# Altium schematic sheet flexPCB.SchDoc
size A
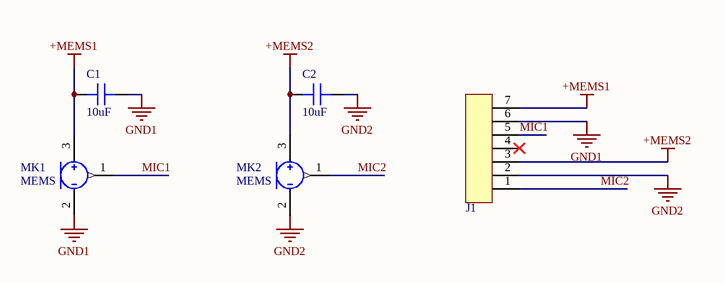
[diagram p0: flexPCB.SchDoc]

## Parts
C1  10uF  [CAP 0402/1005]
C2  10uF  [CAP 0402/1005]
J1  FFC EDGE BOTTOM  [HIROSE_FH58M-7S-0.25SHW-99_BOTTOMFFC]  (value not drawn)
MK1  MEMS  [MIC_CAGRI]
MK2  MEMS  [MIC_CAGRI]

## Nets
+MEMS1: C1.1 J1.7 MK1.3(VDD)
+MEMS2: C2.1 J1.3 MK2.3(VDD)
GND1: C1.2 J1.6 MK1.2(GND)
GND2: C2.2 J1.2 MK2.2(GND)
MIC1: J1.5 MK1.1
MIC2: J1.1 MK2.1

Not connected (* = marked no-connect by the designer): J1 4*

## Library data of the parts
C1 C2 = C1005X5R0J106M050BC: CAP CER 10UF 6.3V X5R 0402; Manufacturer: TDK Corporation; TemperatureRange: -55C ~ 85C; Tolerance: 20%; Value: 10uF; Part Number: C1005X5R0J106M050BC; PartId: 12380; Supplier 1: Digi-Key; Supplier Part Number 1: 445-8920-2-ND; ComponentLink1Description: Datasheet; ComponentLink1URL: https://product.tdk.com/info/en/catalog/datasheets/mlcc_commercial_general_en.pdf; ComponentLink2Description: Digi-Key Listing; ComponentLink2URL: https://www.digikey.com/product-detail/en/tdk-corporation/C1005X5R0J106M050BC/445-8920-2-ND/3507809; TemperatureCoefficient: X5R; Voltage: 6.3V; Price: 0.119; Device Package: 0402 (1005 Metric)
J1 = HIROSE_FH58M-7S-0.25SHW-99_BOTTOM: Bottom FFC Land Pattern for Hirose FH58M-7S-0.25SHW(99) 7-pin Top+Bottom Contact FFC Connector
MK1 MK2 = Mems_Mic_Cagri: Generic 3-pin bottom mount MEMS mic, with Cagri extended footprint